# EAGLE design Smart-LCD_1V0 (EAGLE 7.7.0)

## Sheet 1 of 5: MPU
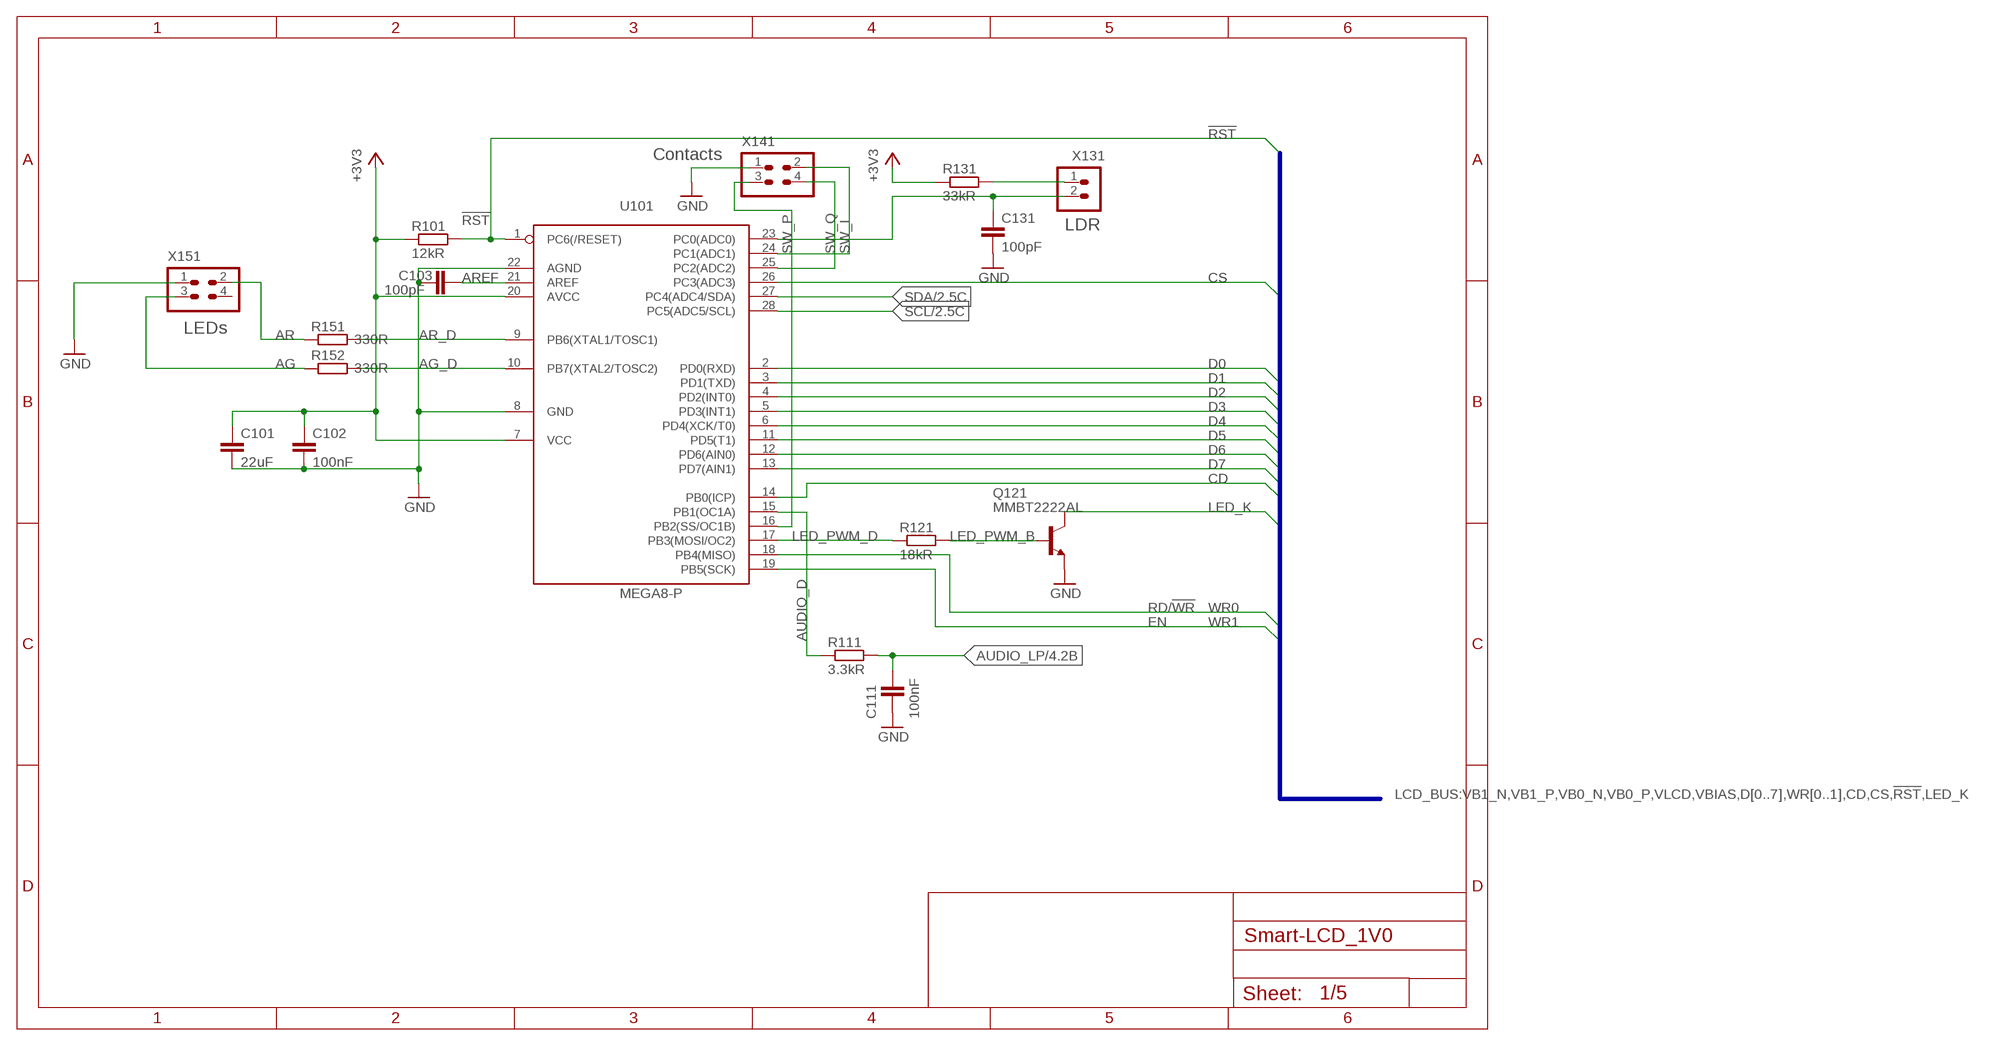
[diagram p0: schematic, sheet 1]

### Parts
C101  22uF  C-EUC0805  [C0805]
C102  100nF  C-EUC0805  [C0805]
C103  100pF  C-EUC0805  [C0805]
C111  100nF  C-EUC0805  [C0805]
C131  100pF  C-EUC0805  [C0805]
Q121  MMBT2222AL  [SOT23]
R101  12kR  R-EU_R0805  [R0805]
R111  3.3kR  R-EU_R0805  [R0805]
R121  18kR  R-EU_R0805  [R0805]
R131  33kR  R-EU_R0805  [R0805]
R151  330R  R-EU_R0805  [R0805]
R152  330R  R-EU_R0805  [R0805]
U101  MEGA8-P  [DIL28-3]
X131  LDR  HEADER-1X2  [1X02]
X141  Switches  HEADER-2X2  [2X02]
X151  LEDs  HEADER-2X2  [2X02]

### Nets
!RST: R101.2 U101.1(PC6(/RESET)) ; also sheet 2
+3V3: C101.1 C102.1 R101.1 R131.1 U101.7(VCC) U101.20(AVCC) ; also sheet 2,3,4
AG: R152.1 X151.3
AG_D: R152.2 U101.10(PB7(XTAL2/TOSC2))
AR: R151.1 X151.2
AR_D: R151.2 U101.9(PB6(XTAL1/TOSC1))
AREF: C103.2 U101.21(AREF)
AUDIO_D: R111.1 U101.15(PB1(OC1A))
AUDIO_LP: C111.1 R111.2 ; also sheet 4
CD: U101.14(PB0(ICP)) ; also sheet 2
CS: U101.26(PC3(ADC3)) ; also sheet 2
D0: U101.2(PD0(RXD)) ; also sheet 2
D1: U101.3(PD1(TXD)) ; also sheet 2
D2: U101.4(PD2(INT0)) ; also sheet 2
D3: U101.5(PD3(INT1)) ; also sheet 2
D4: U101.6(PD4(XCK/T0)) ; also sheet 2
D5: U101.11(PD5(T1)) ; also sheet 2
D6: U101.12(PD6(AIN0)) ; also sheet 2
D7: U101.13(PD7(AIN1)) ; also sheet 2
GND: C101.2 C102.2 C103.1 C111.2 C131.2 Q121.2(E) U101.8(GND) U101.22(AGND) X141.1 X151.1 ; also sheet 2,3,4,5
LDR: C131.1 U101.23(PC0(ADC0)) X131.2
LDR_P: R131.2 X131.1
LED_K: Q121.3(C) ; also sheet 2
LED_PWM_B: Q121.1(B) R121.2
LED_PWM_D: R121.1 U101.17(PB3(MOSI/OC2))
SCL: U101.28(PC5(ADC5/SCL)) ; also sheet 2,3
SDA: U101.27(PC4(ADC4/SDA)) ; also sheet 2,3
SW_I: U101.24(PC1(ADC1)) X141.2
SW_P: U101.16(PB2(SS/OC1B)) X141.3
SW_Q: U101.25(PC2(ADC2)) X141.4
WR0: U101.18(PB4(MISO)) ; also sheet 2
WR1: U101.19(PB5(SCK)) ; also sheet 2
Unconnected: X151.4

### Buses
LCD_BUS:VB1_N,VB1_P,VB0_N,VB0_P,VLCD,VBIAS,D[0..7],WR[0..1],CD,CS,!RST,LED_K

### Notes on the sheet
- Contacts
- LDR
- LEDs
- RD/!WR
- EN

## Sheet 2 of 5: LCD panel
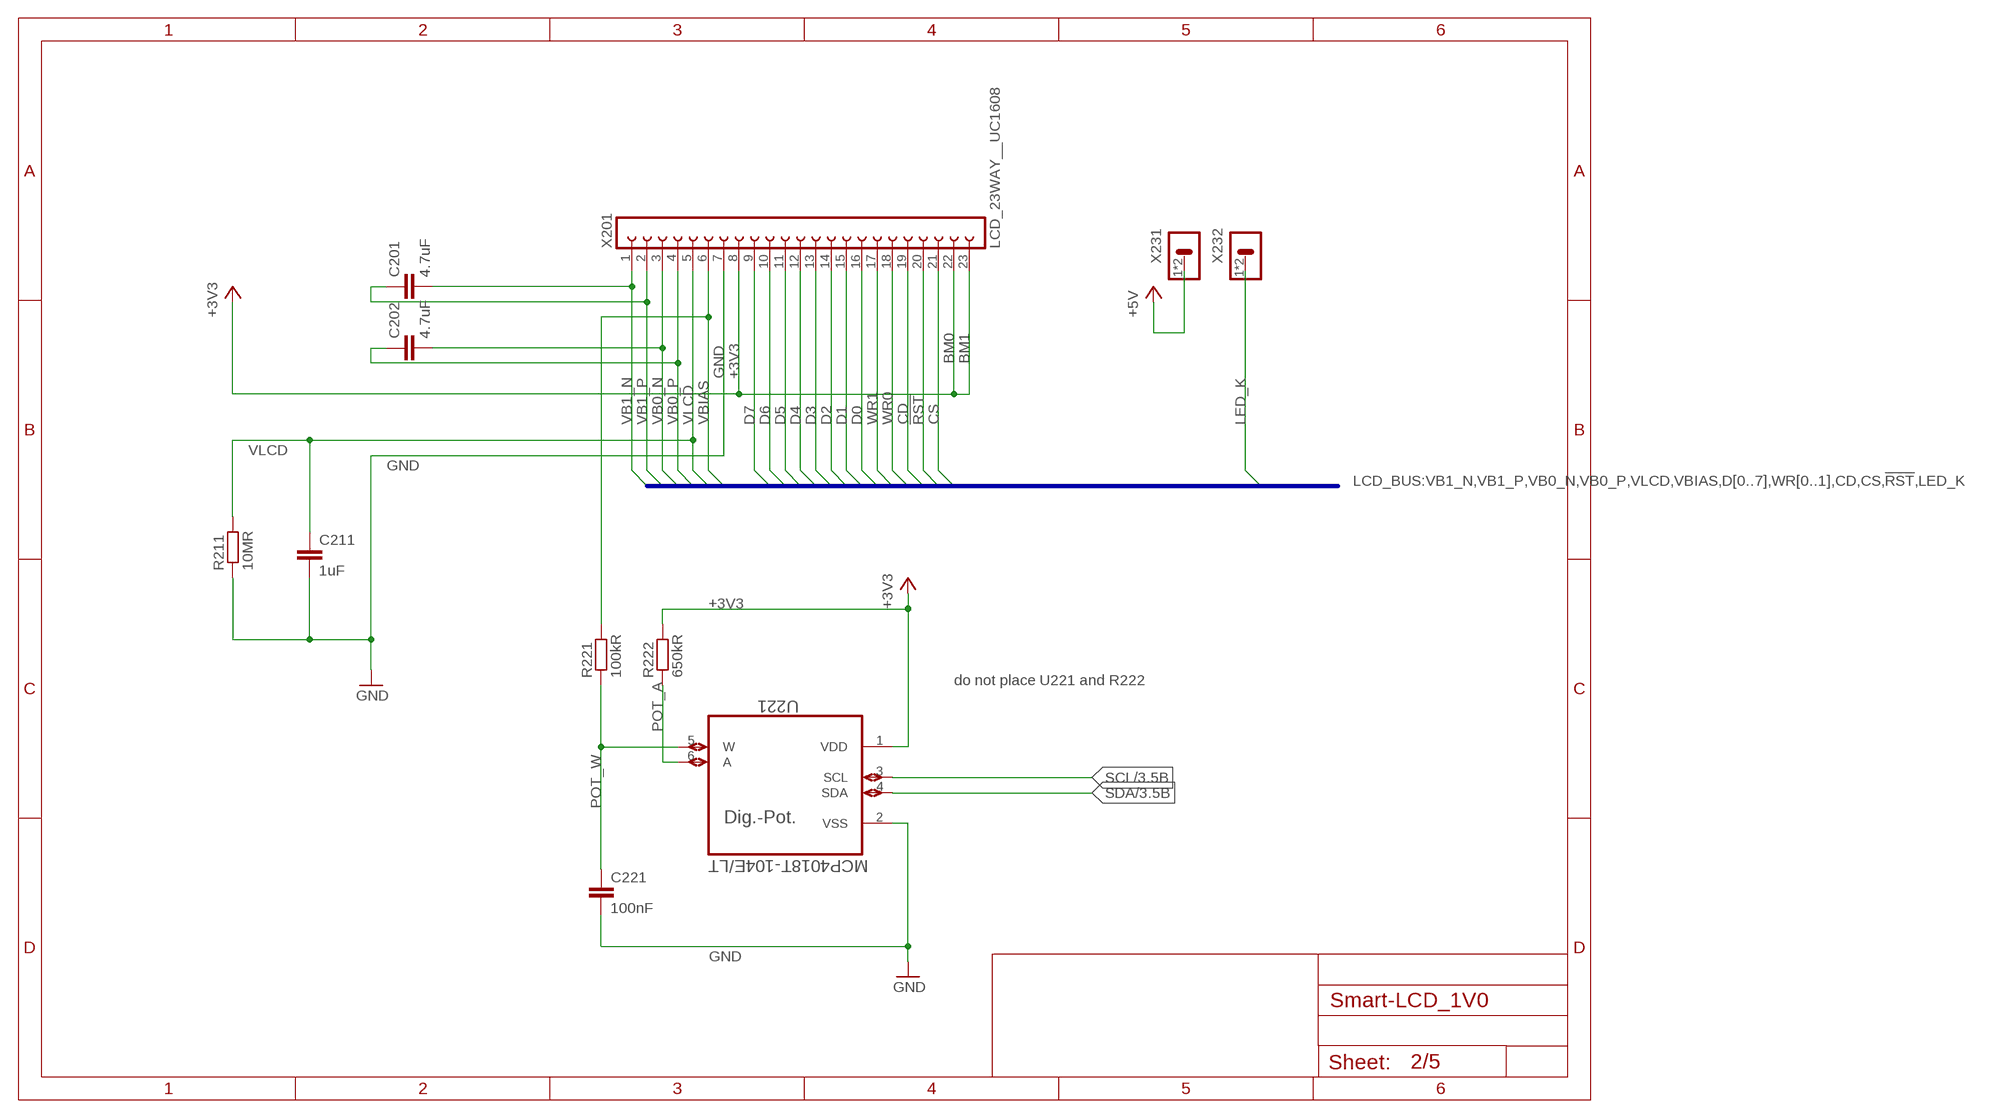
[diagram p1: schematic, sheet 2]

### Parts
C201  4.7uF  C-EUC0805  [C0805]
C202  4.7uF  C-EUC0805  [C0805]
C211  1uF  C-EUC0805  [C0805]
C221  100nF  C-EUC0805  [C0805]
R211  10MR  R-EU_R0805  [R0805]
R221  100kR  R-EU_R0805  [R0805]
R222  650kR  R-EU_R0805  [R0805]
U221  MCP4018T-104E/LT  [SOT65P210X110-6N]
X201  LCD_23WAY__UC1608  [23X01_1MM27__UC1608]
X231  LED_A  CON_1X  [P1-20X0.80]
X232  LED_K  CON_1X  [P1-20X0.80]

### Nets
!RST: X201.20 ; also sheet 1
+3V3: R222.2 U221.1(VDD) X201.8 X201.22 X201.23 ; also sheet 1,3,4
+5V: X231.1 X231.2 ; also sheet 3
CD: X201.19 ; also sheet 1
CS: X201.21 ; also sheet 1
D0: X201.16 ; also sheet 1
D1: X201.15 ; also sheet 1
D2: X201.14 ; also sheet 1
D3: X201.13 ; also sheet 1
D4: X201.12 ; also sheet 1
D5: X201.11 ; also sheet 1
D6: X201.10 ; also sheet 1
D7: X201.9 ; also sheet 1
GND: C211.2 C221.2 R211.1 U221.2(VSS) X201.7 ; also sheet 1,3,4,5
LED_K: X232.1 X232.2 ; also sheet 1
POT_A: R222.1 U221.6(A)
POT_W: C221.1 R221.1 U221.5(W)
SCL: U221.3(SCL) ; also sheet 1,3
SDA: U221.4(SDA) ; also sheet 1,3
VB0_N: C202.2 X201.3
VB0_P: C202.1 X201.4
VB1_N: C201.2 X201.1
VB1_P: C201.1 X201.2
VBIAS: R221.2 X201.6
VLCD: C211.1 R211.2 X201.5
WR0: X201.18 ; also sheet 1
WR1: X201.17 ; also sheet 1

### Buses
LCD_BUS:VB1_N,VB1_P,VB0_N,VB0_P,VLCD,VBIAS,D[0..7],WR[0..1],CD,CS,!RST,LED_K

### Notes on the sheet
- BM0 | BM1
- do not place U221 and R222
- Dig.-Pot.

## Sheet 3 of 5: I2C connector
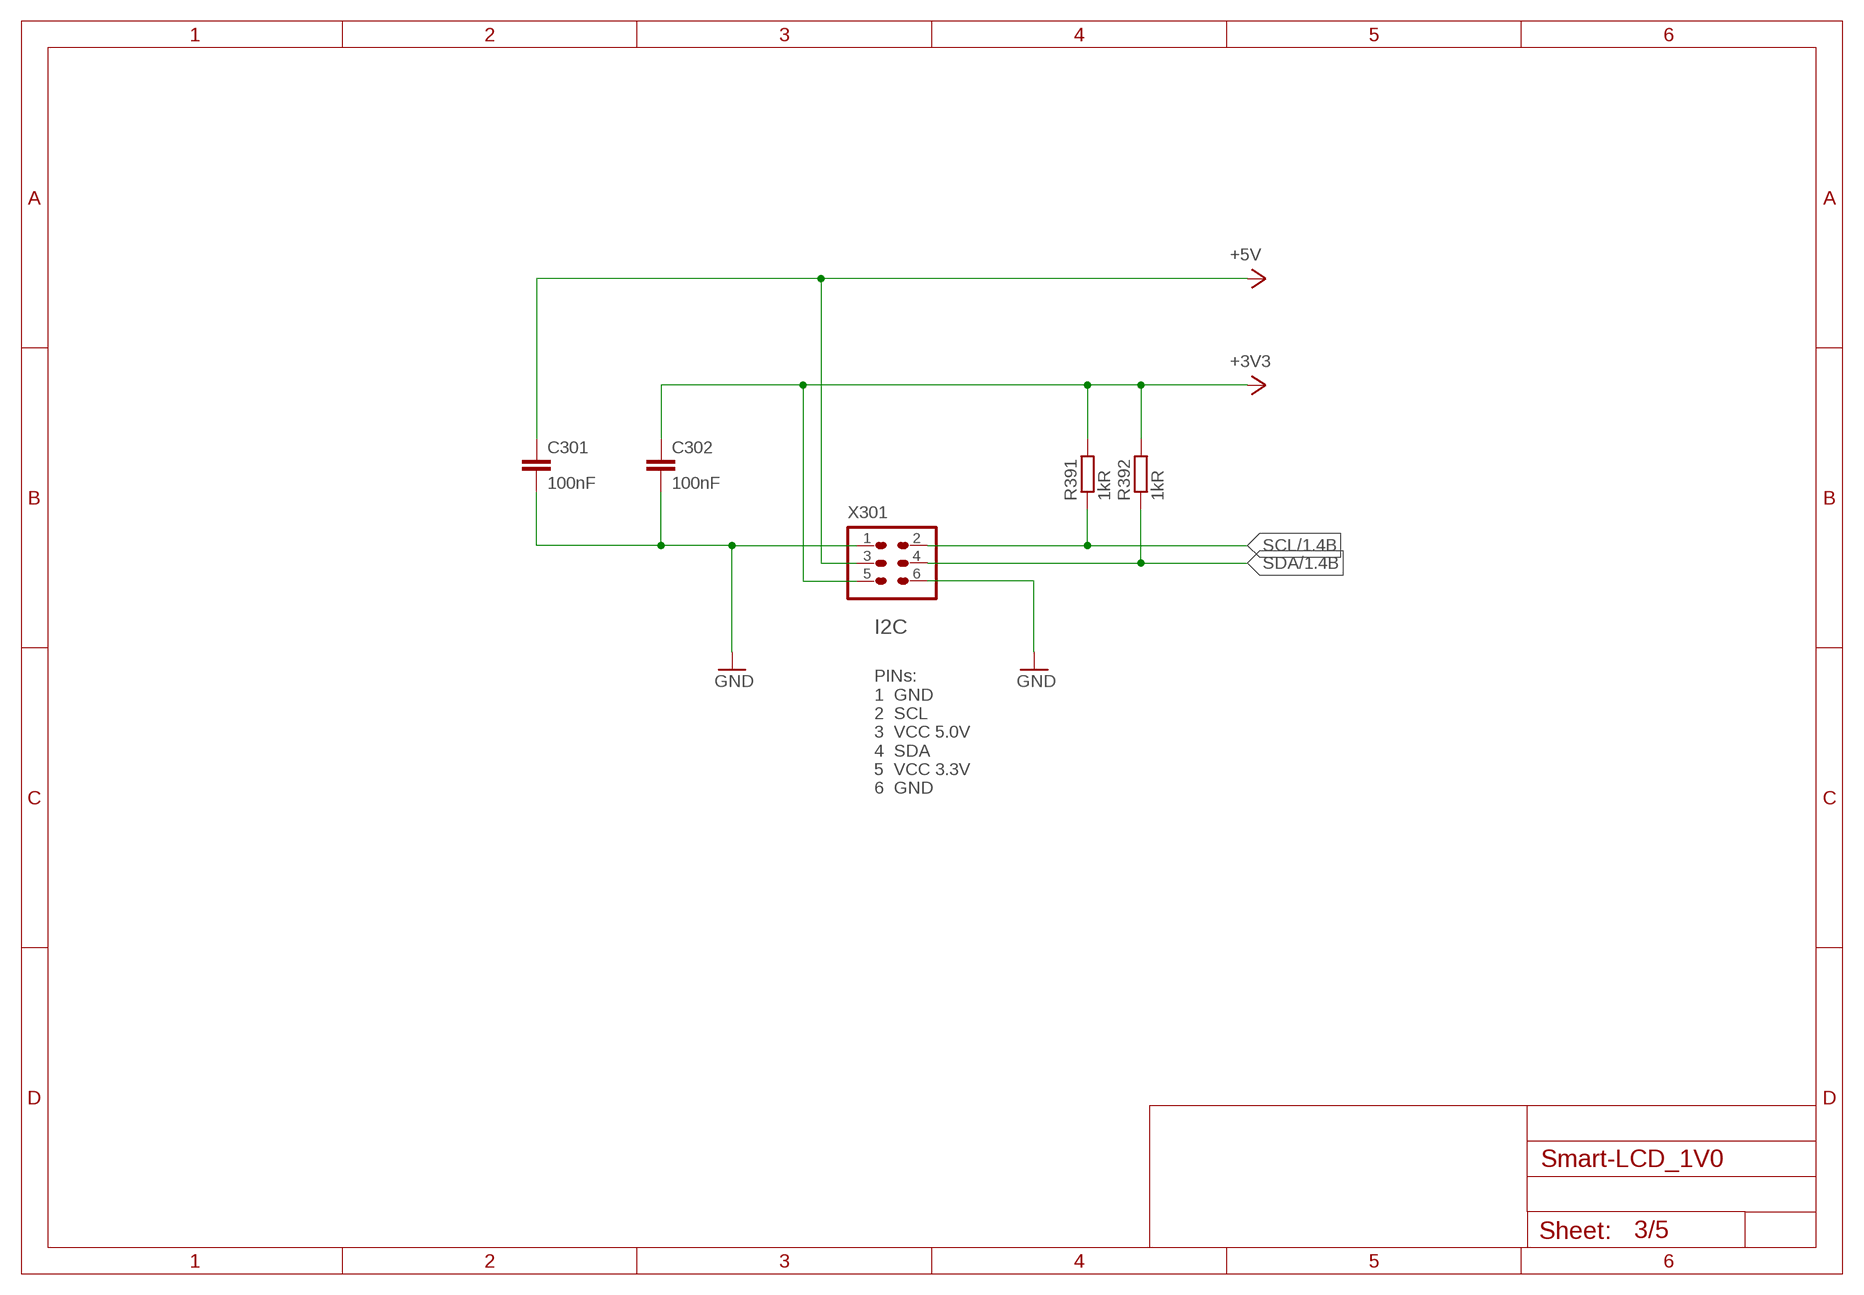
[diagram p2: schematic, sheet 3]

### Parts
C301  100nF  C-EUC0805  [C0805]
C302  100nF  C-EUC0805  [C0805]
R391  1kR  R-EU_R0603  [R0603]
R392  1kR  R-EU_R0603  [R0603]
X301  I2C  HEADER-2X3  [2X03]

### Nets
+3V3: C302.1 R391.2 R392.2 X301.5 ; also sheet 1,2,4
+5V: C301.1 X301.3 ; also sheet 2
GND: C301.2 C302.2 X301.1 X301.6 ; also sheet 1,2,4,5
SCL: R391.1 X301.2 ; also sheet 1,2
SDA: R392.1 X301.4 ; also sheet 1,2

### Notes on the sheet
- I2C
- PINs:
  1  GND
  2  SCL
  3  VCC 5.0V
  4  SDA
  5  VCC 3.3V
  6  GND

## Sheet 4 of 5: Audio
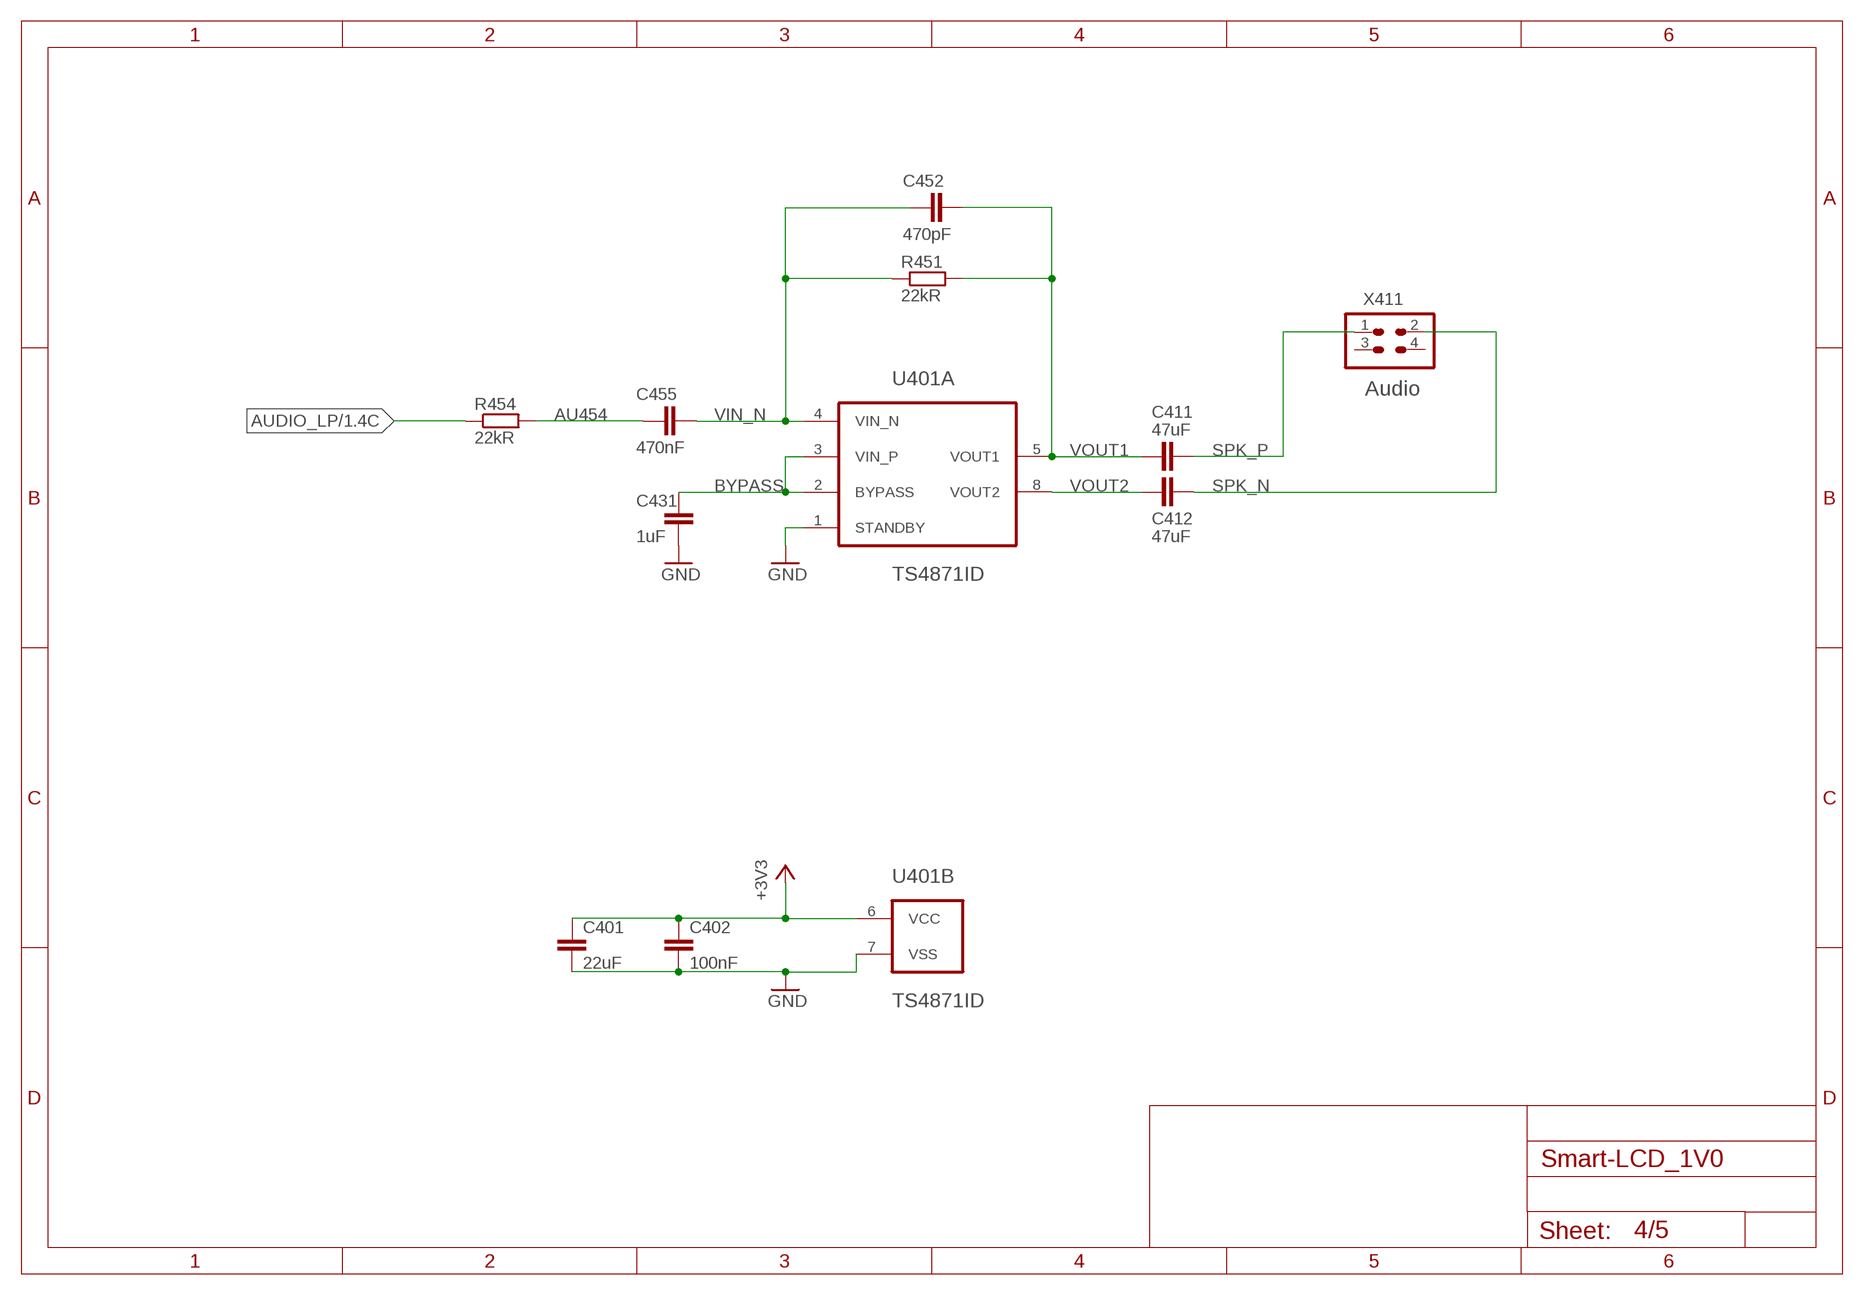
[diagram p3: schematic, sheet 4]

### Parts
C401  22uF  C-EUC0805  [C0805]
C402  100nF  C-EUC0805  [C0805]
C411  47uF  C-EUC0805  [C0805]
C412  47uF  C-EUC0805  [C0805]
C431  1uF  C-EUC0805  [C0805]
C452  470pF  C-EUC0805  [C0805]
C455  470nF  C-EUC0805  [C0805]
R451  22kR  R-EU_R0805  [R0805]
R454  22kR  R-EU_R0805  [R0805]
U401  TS4871ID  [SO08]
X411  Audio  HEADER-2X2  [2X02]

### Nets
+3V3: C401.1 C402.1 U401.6(B:VCC) ; also sheet 1,2,3
AU454: C455.1 R454.2
AUDIO_LP: R454.1 ; also sheet 1
BYPASS: C431.1 U401.2(A:BYPASS) U401.3(A:VIN_P)
GND: C401.2 C402.2 C431.2 U401.1(A:STANDBY) U401.7(B:VSS) ; also sheet 1,2,3,5
SPK_N: C412.2 X411.2
SPK_P: C411.2 X411.1
VIN_N: C452.1 C455.2 R451.1 U401.4(A:VIN_N)
VOUT1: C411.1 C452.2 R451.2 U401.5(A:VOUT1)
VOUT2: C412.1 U401.8(A:VOUT2)
Unconnected: X411.3 X411.4

### Notes on the sheet
- Audio

## Sheet 5 of 5: Holes
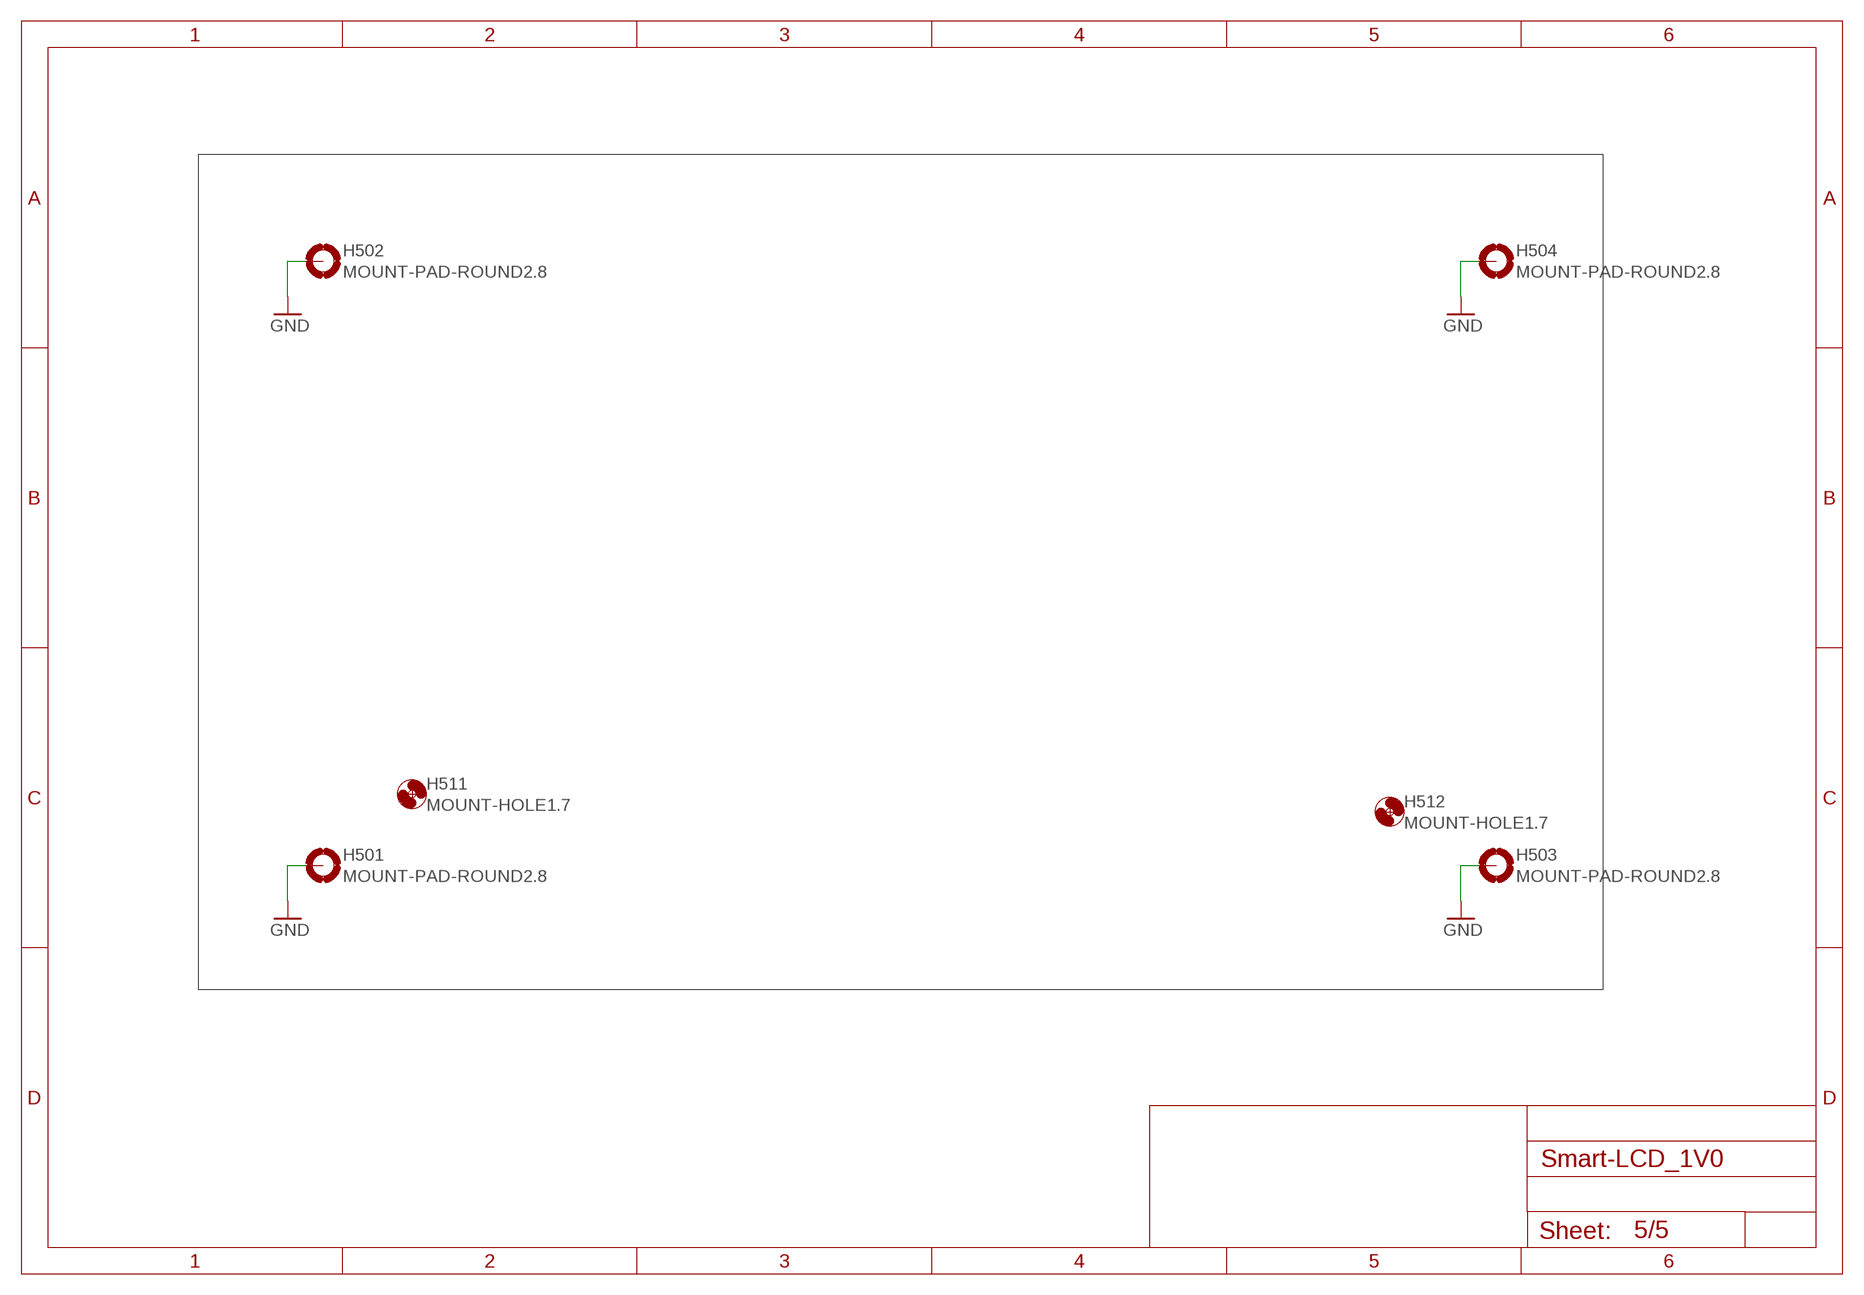
[diagram p4: schematic, sheet 5]

### Parts
H501  MOUNT-PAD-ROUND2.8  [2,8-PAD]
H502  MOUNT-PAD-ROUND2.8  [2,8-PAD]
H503  MOUNT-PAD-ROUND2.8  [2,8-PAD]
H504  MOUNT-PAD-ROUND2.8  [2,8-PAD]
H511  MOUNT-HOLE1.7  [1,7]
H512  MOUNT-HOLE1.7  [1,7]

### Nets
GND: H501.B2,8(MOUNT) H502.B2,8(MOUNT) H503.B2,8(MOUNT) H504.B2,8(MOUNT) ; also sheet 1,2,3,4

## Library data of the parts
C101-C103 C111 C131 C201 C202 C211 C221 C301 C302 C401 C402 C411 C412 C431 C452 C455 = rcl:C-EU: CAPACITOR, European symbol
H501-H504 = holes:MOUNT-PAD-ROUND: MOUNTING PAD, round
H511 H512 = df4iah_holes:MOUNT-HOLE: MOUNTING HOLE with drill center marker
Q121 = df4iah_bipoltransistor:MMBT2222: MMBT2222L, MMBT2222AL, SMMBT2222AL NPN, hfe=300, Ic=600mA, B=300MHz, Vce=40V, Ptot=225mW
R101 R111 R121 R131 R151 R152 R211 R221 R222 R391 R392 R451 R454 = rcl:R-EU_: RESISTOR, European symbol
U101 = df4iah_processors:MEGA8-P: MICROCONTROLLER 8 Kbytes FLASH 1 kbytes SRAM 512 bytes EEPROM USART 4-channel 10 bit ADC 2-channel 8 bit ADC
U221 = df4iah_dig-pot:MCP4018T-104E/LT: Digital POT; MPN: MCP4018T-104E/LT; OC_FARNELL: 1825018; OC_NEWARK: 08R1802; PACKAGE: SOT-6; SUPPLIER: Microchip
U401 = df4iah_opamp:TS4871ID: STMICROELECTRONICS TS4871ID Audio amplifier, AB, 1 channel, 1 W, 2.5V to 5.5V, SOIC-08
X131 = df4iah_connector:HEADER-1X2: Header 1X2 2.54mm
X141 X151 X411 = df4iah_connector:HEADER-2X2: Header 2X2 2.54mm
X201 = df4iah_connector:LCD_23WAY__UC1608: Gfx-LCD UC1608 socket
X231 X232 = df4iah_connector:CON_1X: THT contact 2mm x 0.80mm
X301 = df4iah_connector:HEADER-2X3: Header 2X3 2.54mm

## Board
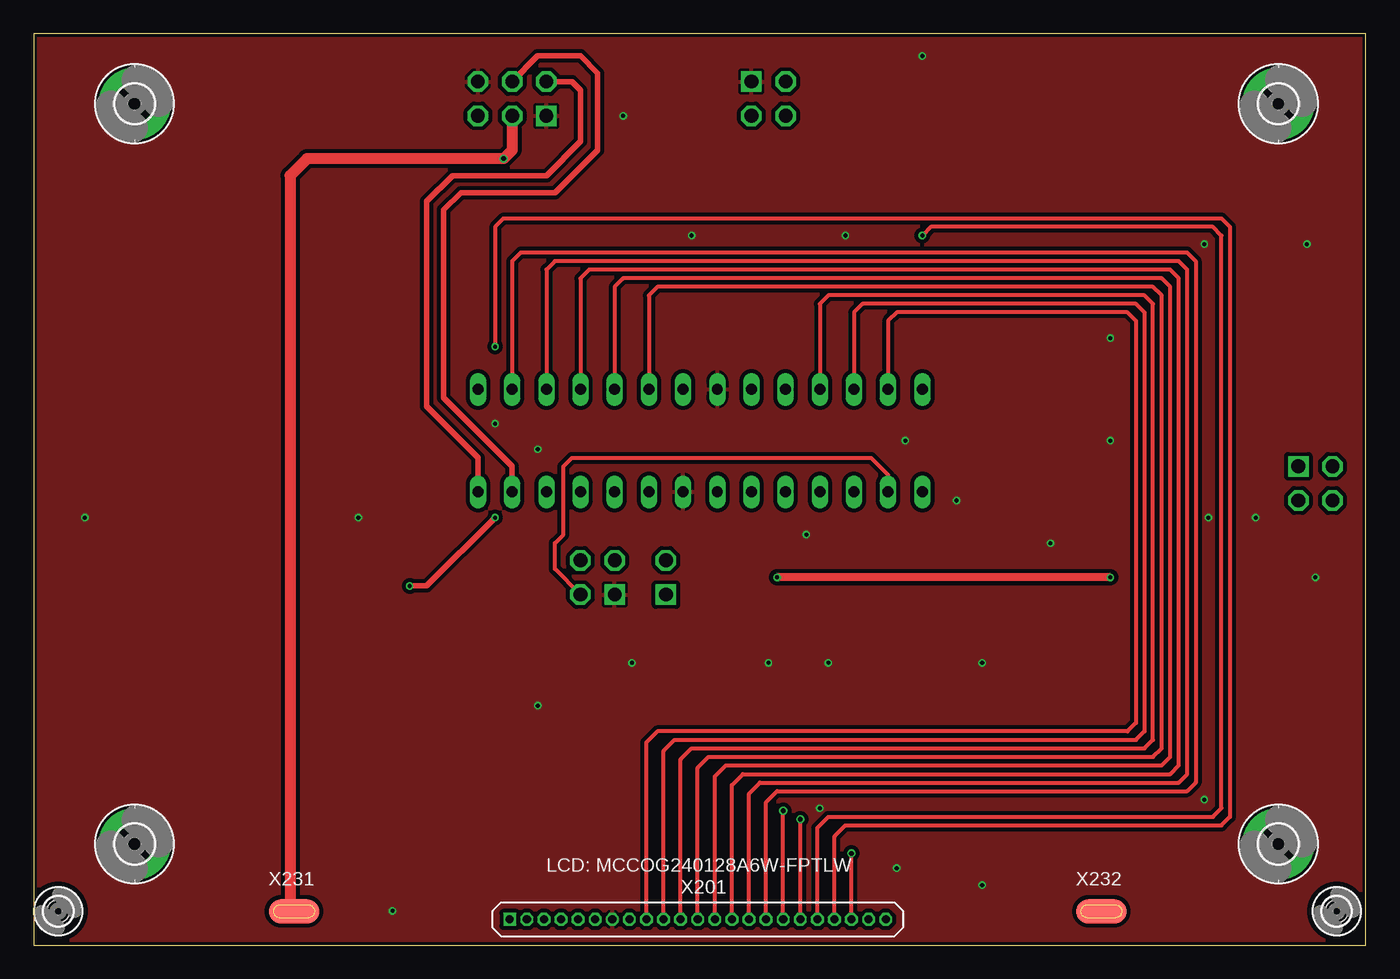
[diagram p5: board, top side]
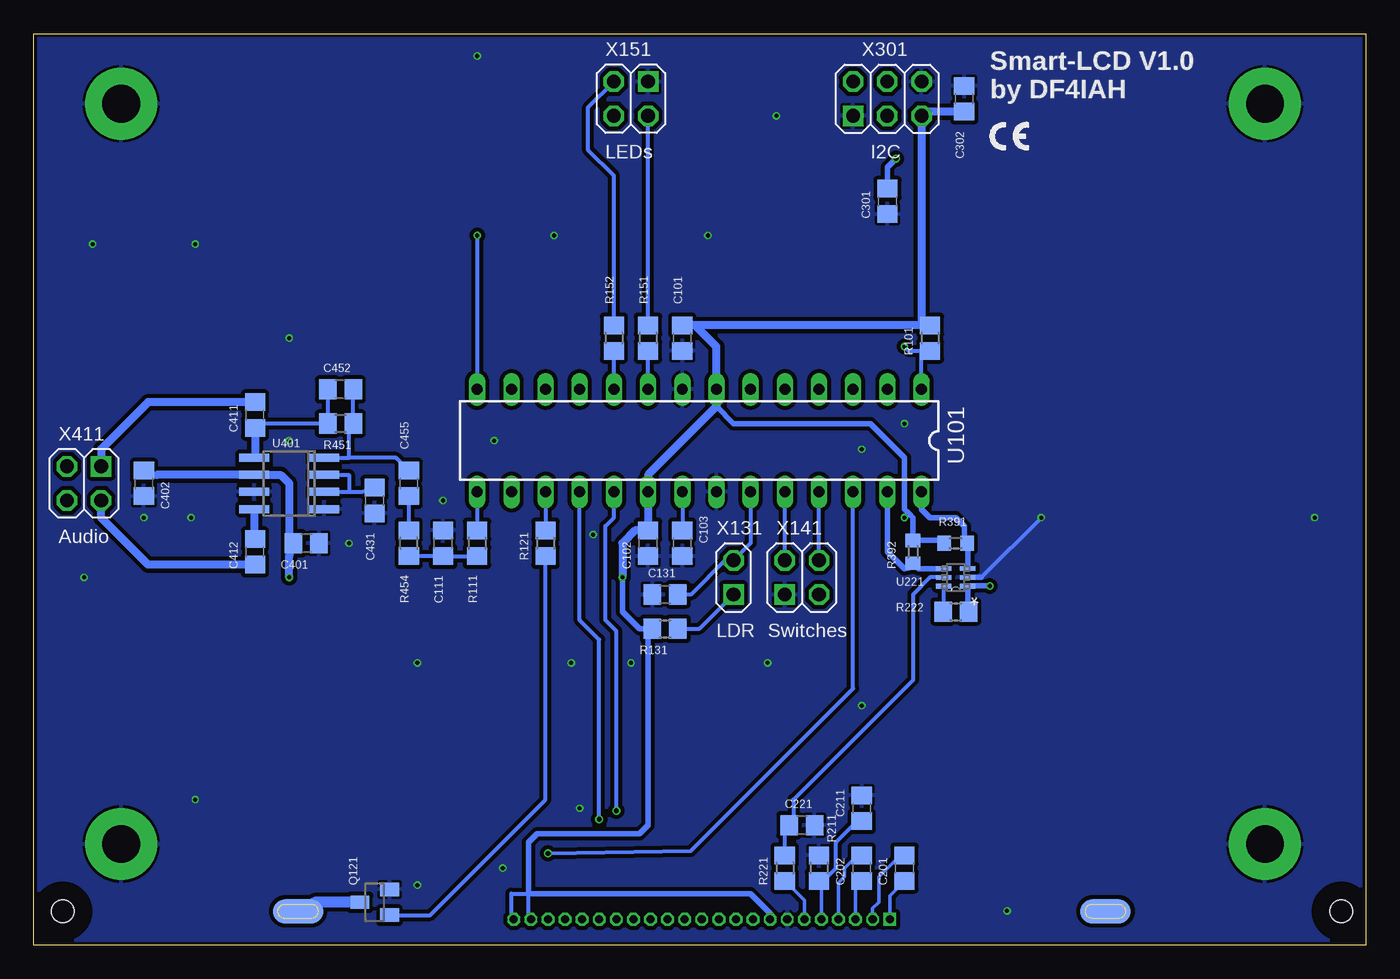
[diagram p6: board, bottom side, seen from below]

Size 99 x 67.7 mm. Coordinates in mm from the lower left corner, seen from the top.
Outline: 0,0 99,0 99,67.7 0,67.7 0,0
Copper layers (1*16): Top 0.035mm / dielectric 1.45mm / Bottom 0.035mm
Design rules "Smart-LCD_1V0 *": minimum track width 0.15mm, minimum drill 0.3mm, track to track 0.3mm, track to pad 0.5mm, pad to pad 0.205mm, via to via 0.205mm, smd to smd 0mil, copper to edge 0.25mm, drill to drill 0.35mm, minimum pad ring 0.175mm, minimum via ring 0.125mm, stop-mask expansion 0.05mm, vias tented up to drill 0.35mm, thermal gap 0.2mm

### Footprints (pad centres in the part's own frame; a part is rotated, then mirrored left to right if it is on the bottom)
C0805 = smd 1.3 x 1.5: 1 -0.95,0; 2 0.95,0
2,8-PAD = drill 2.8 pad 5.334: B2,8 0,0
1,7 = hole 1.7: 0,0
SOT23 = smd 1 x 1.4: 1 -0.95,-1.1; 2 0.95,-1.1; 3 0,1.1
R0805 = smd 1.3 x 1.5: 1 -0.95,0; 2 0.95,0
R0603 = smd 1 x 1.1: 1 -0.85,0; 2 0.85,0
DIL28-3 = drill 0.813 long: 1 -16.51,-3.81; 2 -13.97,-3.81; 3 -11.43,-3.81; 4 -8.89,-3.81; 5 -6.35,-3.81; 6 -3.81,-3.81; 7 -1.27,-3.81; 8 1.27,-3.81; 9 3.81,-3.81; 10 6.35,-3.81; 11 8.89,-3.81; 12 11.43,-3.81; 13 13.97,-3.81; 14 16.51,-3.81; 15 16.51,3.81; 16 13.97,3.81; 17 11.43,3.81; 18 8.89,3.81; 19 6.35,3.81; 20 3.81,3.81; 21 1.27,3.81; 22 -1.27,3.81; 23 -3.81,3.81; 24 -6.35,3.81; 25 -8.89,3.81; 26 -11.43,3.81; 27 -13.97,3.81; 28 -16.51,3.81
SOT65P210X110-6N = smd 1.168 x 0.356: 1 -0.889,0.66; 2 -0.889,0; 3 -0.889,-0.66; 4 0.889,-0.66; 5 0.889,0; 6 0.889,0.66
SO08 = smd 0.6 x 2.2: 1 -1.905,-2.6; 2 -0.635,-2.6; 3 0.635,-2.6; 4 1.905,-2.6; 5 1.905,2.6; 6 0.635,2.6; 7 -0.635,2.6; 8 -1.905,2.6
1X02 = drill 1.016 square: 1 0,0 | drill 1.016 octagon: 2 0,2.54
2X02 = drill 1.016 square: 1 -1.27,-1.27 | drill 1.016 octagon: 2 -1.27,1.27; 3 1.27,-1.27; 4 1.27,1.27
23X01_1MM27__UC1608 = drill 0.6 pad 0.8 square: 1 0,0 | drill 0.6 pad 0.8 octagon: 2 1.27,0; 3 2.54,0; 4 3.81,0; 5 5.08,0; 6 6.35,0; 7 7.62,0; 8 8.89,0; 9 10.16,0; 10 11.43,0; 11 12.7,0; 12 13.97,0; 13 15.24,0; 14 16.51,0; 15 17.78,0; 16 19.05,0; 17 20.32,0; 18 21.59,0; 19 22.86,0; 20 24.13,0; 21 25.4,0; 22 26.67,0; 23 27.94,0
P1-20X0.80 = smd 3.75 x 1.8: 1 0,0 | smd 3.75 x 1.8 bottom: 2 0,0
2X03 = drill 1.016 square: 1 -2.54,-1.27 | drill 1.016 octagon: 2 -2.54,1.27; 3 0,-1.27; 4 0,1.27; 5 2.54,-1.27; 6 2.54,1.27

### Placement (x,y rotation side)
C101  50.8,45.09 270 bottom
C102  53.34,29.84 270 bottom
C103  50.8,29.84 90 bottom
C111  68.58,29.84 90 bottom
C131  52.07,26.04 180 bottom
C201  34.29,5.71 270 bottom
C202  37.47,5.71 270 bottom
C211  37.47,10.16 90 bottom
C221  41.91,8.89 0 bottom
C301  35.56,55.24 270 bottom
C302  29.84,62.87 90 bottom
C401  78.74,29.84 0 bottom
C402  90.81,34.29 270 bottom
C411  82.55,39.37 90 bottom
C412  82.55,29.21 270 bottom
C431  73.66,33.02 270 bottom
C452  76.2,41.27 180 bottom
C455  71.12,34.29 90 bottom
H501  7.5,7.5 0 top
H502  7.5,62.5 0 top
H503  92.5,7.5 0 top
H504  92.5,62.5 0 top
H511  1.83,2.5 0 top
H512  96.83,2.5 0 top
Q121  73.66,3.17 90 bottom
R101  32.38,45.09 270 bottom
R111  66.04,29.84 270 bottom
R121  60.96,29.84 270 bottom
R131  52.07,23.5 0 bottom
R151  53.34,45.09 270 bottom
R152  55.88,45.09 270 bottom
R211  40.64,5.71 270 bottom
R221  43.18,5.71 270 bottom
R222  30.48,24.77 0 bottom
R391  30.48,29.84 180 bottom
R392  33.66,29.21 90 bottom
R451  76.2,38.73 180 bottom
R454  71.12,29.84 90 bottom
U101  49.53,37.47 180 bottom
U221  30.48,27.3 180 bottom
U401  80.01,34.29 90 bottom
X131  46.99,26.04 0 bottom
X141  41.91,27.3 0 bottom
X151  54.61,62.87 180 bottom
X201  35.38,1.91 0 top
X231  19.35,2.5 0 top
X232  79.35,2.5 0 top
X301  35.56,62.87 0 bottom
X411  95.25,34.29 180 bottom

### Tracks (layer width: path | path; a pad name or v marks a point on that pad's centre or on a via)
!RST  (via drill 0.3)
  Top 0.3: X201.20 59.51,8.07 60.33,8.89 88.27,8.89 88.9,9.53 88.9,53.34 88.27,53.98 34.92,53.98 34.29,53.34 v34.29,44.45
  Bottom 0.3: v34.29,44.45 33.98,44.13 33.02,44.13 | 33.02,44.13 R101.2 | U101.1 33.02,44.13
+3V3  (via drill 0.3)
  Top 0.406: v27.94,26.67 29.21,26.67 v34.29,31.75
  Top 0.61: v80.01,27.3 v55.24,27.3
  Bottom 0.3: 29.84,24.13 29.84,24.77 R222.2 29.21,24.45 29.21,24.13 | 29.57,26.67 U221.1 | X201.22 62.23,1.91 62.23,3.81 63.5,3.81 63.5,1.91 X201.23 | 53.34,23.18 R131.1
  Bottom 0.305: R222.2 29.59,24.83
  Bottom 0.406: 29.59,24.83 U221.1 | X201.8 44.27,2.36 45.72,3.81 62.23,3.81 62.23,7.62 61.59,8.26 53.98,8.26 53.34,8.89 53.34,23.18 | R101.1 33.02,46.03 | 53.34,34.92 U101.20 | 49.84,46.03 C101.1 | R391.2 31.55,30.06 R392.2 33.66,31.75 33.97,32.07 | 89.86,34.92 90.49,34.92 C402.1 | 80.01,29.53 C401.1 | v55.24,27.3 55.24,24.77 53.98,23.5 R131.1 | 33.97,32.07 34.29,32.38 34.29,36.2 36.83,38.73 46.99,38.73 48.26,40.01 | v34.29,31.75 33.97,32.07 | 29.57,26.67 v27.94,26.67
  Bottom 0.61: U401.6 89.86,34.92 | U401.6 83.19,34.92 | C101.1 33.02,46.03 X301.5 32.7,61.91 C302.1 | 53.34,34.92 48.26,40.01 U101.7 48.26,44.45 49.84,46.03 | U101.20 C102.1 54.3,30.8 55.24,29.84 v55.24,27.3 | U401.6 80.64,34.92 80.01,34.29 80.01,29.53 | v80.01,27.3 80.01,28.89 C401.1
+5V  (via drill 0.35)
  Top 0.813: X231.2 19.05,2.81 19.05,57.15 20.32,58.42 v34.92,58.42 35.56,59.05 X301.3
  Bottom 0.406: C301.1 35.56,57.78 v34.92,58.42
AG
  Bottom 0.3: R152.1 55.88,57.15 57.78,59.05 57.78,62.23 X151.3
AG_D
  Bottom 0.3: U101.10 R152.2
AR
  Bottom 0.3: R151.1 X151.2
AR_D
  Bottom 0.3: U101.9 R151.2
AREF
  Bottom 0.3: U101.21 C103.2
AU454
  Bottom 0.3: C455.1 R454.2
AUDIO_D
  Bottom 0.3: U101.15 R111.1
AUDIO_LP
  Bottom 0.3: R111.2 C111.1 R454.1
BYPASS
  Bottom 0.3: U401.2 75.56,33.66 | 75.56,33.66 74.61,33.66 C431.1 | U401.3 75.56,34.92 75.56,33.66
CD  (via drill 0.3)
  Top 0.3: X201.19 58.24,8.71 59.05,9.53 87.63,9.53 88.27,10.16 88.27,52.7 87.63,53.34 66.67,53.34 v66.04,52.7
  Bottom 0.3: v66.04,52.7 U101.14
CS  (via drill 0.35)
  Top 0.3: X201.21 v60.78,6.8
  Bottom 0.3: v60.78,6.8 50.16,6.99 38.1,19.05 U101.26
D0
  Top 0.3: X201.16 54.43,10.62 55.24,11.43 85.72,11.43 86.36,12.06 86.36,50.8 85.72,51.44 36.2,51.44 35.56,50.8 U101.2
D1
  Top 0.3: X201.15 53.16,11.25 53.98,12.06 85.09,12.06 85.72,12.7 85.72,50.16 85.09,50.8 38.73,50.8 38.1,50.16 U101.3
D2
  Top 0.3: X201.14 51.89,11.88 52.7,12.7 84.45,12.7 85.09,13.34 85.09,49.53 84.45,50.16 41.27,50.16 40.64,49.53 U101.4
D3
  Top 0.3: X201.13 50.62,12.52 51.44,13.34 83.82,13.34 84.45,13.97 84.45,48.9 83.82,49.53 43.81,49.53 43.18,48.9 U101.5
D4
  Top 0.3: X201.12 49.35,13.15 50.16,13.97 83.19,13.97 83.82,14.61 83.82,48.26 83.19,48.9 46.35,48.9 45.72,48.26 U101.6
D5
  Top 0.3: X201.11 48.08,13.79 48.9,14.61 82.55,14.61 83.19,15.24 83.19,47.62 82.55,48.26 59.05,48.26 58.42,47.62 U101.11
D6
  Top 0.3: X201.10 46.81,14.43 47.62,15.24 81.92,15.24 82.55,15.88 82.55,46.99 81.92,47.62 61.59,47.62 60.96,46.99 U101.12
D7
  Top 0.3: X201.9 45.54,15.06 46.35,15.88 81.28,15.88 81.92,16.51 81.92,46.35 81.28,46.99 64.14,46.99 63.5,46.35 U101.13
GND  (via drill 0.3)
  Bottom 0.254: 42.86,1.76 X201.7
  Bottom 0.3: 40.64,8.57 C221.2 | 28.57,27.3 v24.13,31.75
  Bottom 0.406: U221.2 28.57,27.3
  other vias: 87,10.79 3.81,31.75 87.3,31.75 87,52.07 58.42,10.16 48.9,52.7 60.33,52.7 26.67,2.54 70.48,4.45 64.14,5.71 37.47,17.78 44.45,20.95 54.61,20.95 59.05,20.95 70.48,20.95 64.77,37.47 80.01,45.09 80.01,37.47 75.56,29.84 94.61,52.07 90.81,31.75 95.25,27.3 68.58,33.02 57.42,30.48 34.29,38.73 37.47,36.83 66.04,66.04 43.81,61.59
  pour Bottom: 0,0 0,67.7 99.06,67.7 99.06,0
  pour Top: 0,0 0,67.7 99.06,67.7 99.06,0
LDR
  Bottom 0.3: U101.23 45.72,29.84 X131.2 47.62,28.57 50.16,26.04 C131.1
LDR_P
  Bottom 0.3: R131.2 49.53,23.5 X131.1
LED_K
  Bottom 0.813: Q121.3 78.11,3.17 78.74,2.54 79.31,2.54 X232.2
LED_PWM_B
  Bottom 0.3: Q121.1 69.53,2.23 60.96,10.79 R121.2
LED_PWM_D
  Bottom 0.3: U101.17 R121.1
POT_A
  Bottom 0.305: R222.1 31.37,24.83 U221.6
POT_W
  Bottom 0.3: R221.1 43.18,8.57 C221.1 42.55,9.21 42.55,10.79 33.66,19.68 33.66,26.04 32.38,27.3 U221.5
SCL
  Top 0.406: X301.2 40.01,64.14 40.64,63.5 40.64,59.69 38.1,57.15 31.11,57.15 29.21,55.24 29.21,40.01 33.02,36.2 U101.28
  Bottom 0.3: 29.84,30.06 R391.1
  Bottom 0.305: 29.59,29.81 R391.1
  Bottom 0.406: U221.3 29.59,29.81 | 29.84,30.06 29.84,31.11 30.48,31.75 32.38,31.75 33.02,32.38 U101.28
SDA
  Top 0.406: U101.27 35.56,35.56 30.48,40.64 30.48,54.61 31.75,55.88 38.73,55.88 41.91,59.05 41.91,64.77 40.64,66.04 37.47,66.04 X301.4
  Bottom 0.3: 33.9,27.96 R392.1 | 33.26,27.96 R392.1 | 34.29,27.94 34.08,27.94 R392.1
  Bottom 0.406: U221.4 33.26,27.96 | U101.27 35.56,29.21 34.29,27.94
SPK_N
  Bottom 0.61: C412.2 90.49,28.26 93.98,31.75 X411.2
SPK_P
  Bottom 0.61: C411.2 90.49,40.32 93.98,36.83 X411.1
SW_I
  Bottom 0.3: X141.2 U101.24
SW_P
  Top 0.3: U101.16 63.5,34.92 62.23,36.2 40.01,36.2 39.37,35.56 39.37,30.48 38.73,29.84 38.73,27.94 X141.3
SW_Q
  Bottom 0.3: X141.4 U101.25
VB0_N
  Bottom 0.254: X201.3 37.92,4.76 C202.2
VB0_P
  Bottom 0.254: X201.4 39.19,4.62 38.73,5.08 38.73,5.71 38.1,6.35 37.78,6.35 C202.1
VB1_N
  Bottom 0.254: X201.1 35.38,3.67 C201.2
VB1_P
  Bottom 0.254: X201.2 36.65,2.72 36.2,3.17 36.2,5.08 34.92,6.35 34.6,6.35 C201.1
VBIAS
  Bottom 0.254: X201.6 41.73,3.31 R221.2
VIN_N
  Bottom 0.3: U401.4 75.56,36.2 | 75.56,36.2 75.56,38.1 | R451.1 C452.1 | C455.2 72.08,36.2 75.56,36.2
  Bottom 0.406: R451.1 75.56,38.1
VLCD
  Bottom 0.254: X201.5 40.46,4.58 R211.2
  Bottom 0.3: R211.2 40.32,4.76 39.37,5.71 39.37,7.62 38.1,8.89 37.78,8.89 C211.1
VOUT1
  Bottom 0.3: C452.2 R451.2 82.23,38.73 C411.1
  Bottom 0.61: C411.1 82.55,36.26 U401.5
VOUT2
  Bottom 0.61: U401.8 82.61,30.22 C412.1
WR0  (via drill 0.35)
  Top 0.3: X201.18 v56.97,9.35
  Bottom 0.3: v56.97,9.35 56.97,22.68 58.42,24.13 U101.18
WR1  (via drill 0.35)
  Top 0.3: X201.17 v55.7,9.98
  Bottom 0.3: v55.7,9.98 55.7,23.32 56.52,24.13 56.52,31.11 55.88,31.75 U101.19

### Text on the board
tPlace: LCD: MCCOG240128A6W-FPTLW
bPlace: Smart-LCD V1.0 / by DF4IAH
bNames: I2C | LEDs | Audio | Switches | LDR